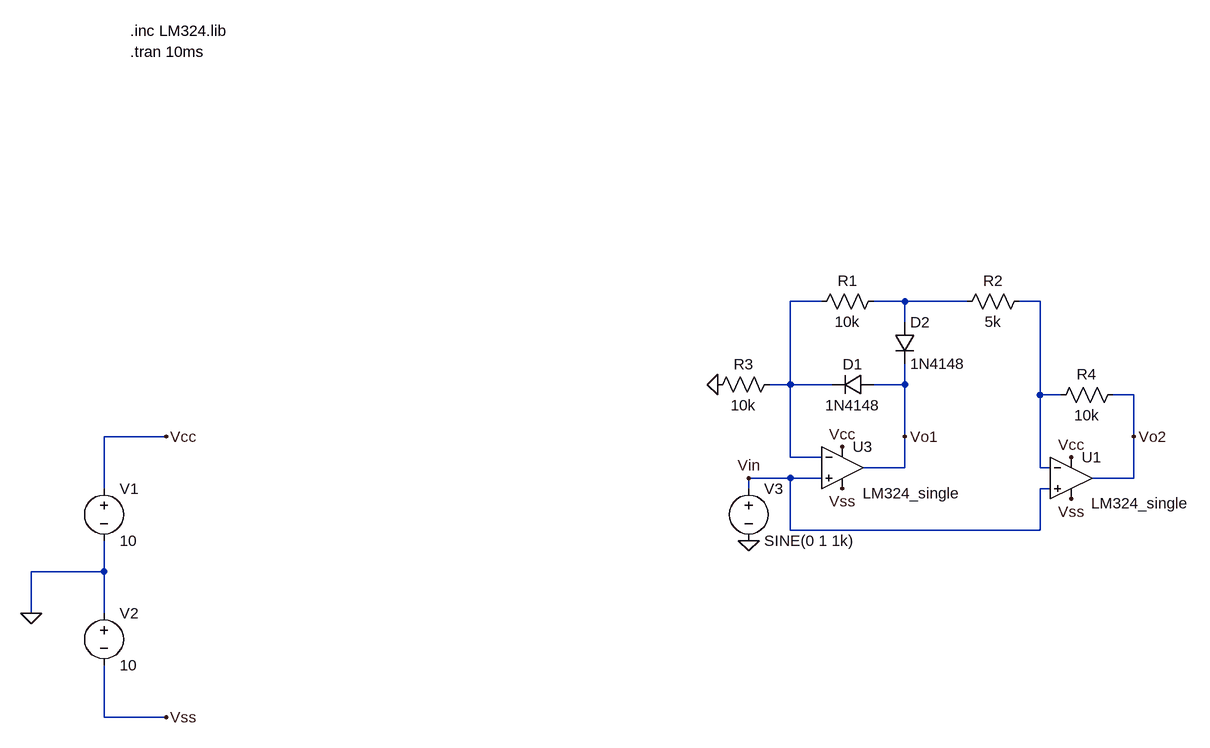
[diagram p0: schematic Circuito 3.asc]
Circuito 3.asc, the LTspice schematic file:
Version 4.1
SHEET 1 4928 940
WIRE 672 240 624 240
WIRE 800 240 752 240
WIRE 896 240 800 240
WIRE 1008 240 976 240
WIRE 800 272 800 240
WIRE 624 368 624 240
WIRE 624 368 592 368
WIRE 688 368 624 368
WIRE 800 368 800 336
WIRE 800 368 752 368
WIRE 1008 384 1008 240
WIRE 1040 384 1008 384
WIRE 1152 384 1120 384
WIRE -336 448 -432 448
WIRE 800 448 800 368
WIRE 1152 448 1152 384
WIRE 624 480 624 368
WIRE 672 480 624 480
WIRE 800 496 800 448
WIRE 800 496 736 496
WIRE 1008 496 1008 384
WIRE 1024 496 1008 496
WIRE 624 512 560 512
WIRE 672 512 624 512
WIRE 1152 512 1152 448
WIRE 1152 512 1088 512
WIRE -432 528 -432 448
WIRE 560 528 560 512
WIRE 1024 528 1008 528
WIRE 624 592 624 512
WIRE 1008 592 1008 528
WIRE 1008 592 624 592
WIRE -432 656 -432 608
WIRE -432 656 -544 656
WIRE -544 720 -544 656
WIRE -432 720 -432 656
WIRE -432 880 -432 800
WIRE -336 880 -432 880
FLAG -544 720 0
FLAG -336 448 Vcc
FLAG -336 880 Vss
FLAG 704 464 Vcc
FLAG 704 528 Vss
FLAG 560 608 0
FLAG 512 368 0
FLAG 1056 480 Vcc
FLAG 1056 544 Vss
FLAG 1152 448 Vo2
FLAG 800 448 Vo1
FLAG 560 512 Vin
SYMBOL voltage -432 512 R0
WINDOW 123 0 0 Left 0
WINDOW 39 0 0 Left 0
SYMATTR InstName V1
SYMATTR Value 10
SYMBOL voltage -432 704 R0
WINDOW 123 0 0 Left 0
WINDOW 39 0 0 Left 0
SYMATTR InstName V2
SYMATTR Value 10
SYMBOL OpAmps\\opamp2 704 432 R0
WINDOW 3 31 103 Left 2
SYMATTR Value LM324_single
SYMATTR InstName U3
SYMBOL diode 752 352 R90
WINDOW 0 0 32 VBottom 2
WINDOW 3 32 32 VTop 2
SYMATTR InstName D1
SYMATTR Value 1N4148
SYMBOL diode 784 272 R0
SYMATTR InstName D2
SYMATTR Value 1N4148
SYMBOL res 608 352 R90
WINDOW 0 0 56 VBottom 2
WINDOW 3 32 56 VTop 2
SYMATTR InstName R3
SYMATTR Value 10k
SYMATTR SpiceLine tol=1
SYMBOL voltage 560 512 R0
WINDOW 123 0 0 Left 0
WINDOW 39 0 0 Left 0
SYMATTR InstName V3
SYMATTR Value SINE(0 1 1k)
SYMBOL res 768 224 R90
WINDOW 0 0 56 VBottom 2
WINDOW 3 32 56 VTop 2
SYMATTR InstName R1
SYMATTR Value 10k
SYMATTR SpiceLine tol=1
SYMBOL res 992 224 R90
WINDOW 0 0 56 VBottom 2
WINDOW 3 32 56 VTop 2
SYMATTR InstName R2
SYMATTR Value 5k
SYMATTR SpiceLine tol=1
SYMBOL OpAmps\\opamp2 1056 448 R0
WINDOW 3 31 103 Left 2
SYMATTR Value LM324_single
SYMATTR InstName U1
SYMBOL res 1136 368 R90
WINDOW 0 0 56 VBottom 2
WINDOW 3 32 56 VTop 2
SYMATTR InstName R4
SYMATTR Value 10k
SYMATTR SpiceLine tol=1
TEXT -392 -176 Left 2 !.inc LM324.lib
TEXT -392 -144 Left 2 !.tran 10ms

The netlist it stands for:
* Circuito 3.asc
V1 Vcc 0 10
V2 0 Vss 10
X§U3 Vin N001 Vcc Vss Vo1 LM324_single  ; pins In+ In- V+ V- OUT
D1 Vo1 N001 1N4148
D2 N002 Vo1 1N4148
R3 N001 0 10k tol=1
V3 Vin 0 SINE(0 1 1k)
R1 N002 N001 10k tol=1
R2 N003 N002 5k tol=1
X§U1 Vin N003 Vcc Vss Vo2 LM324_single  ; pins In+ In- V+ V- OUT
R4 Vo2 N003 10k tol=1
.model D D
.lib standard.dio
.inc LM324.lib
.tran 10ms
.backanno
.end